# EAGLE design page1 (EAGLE 4.16)
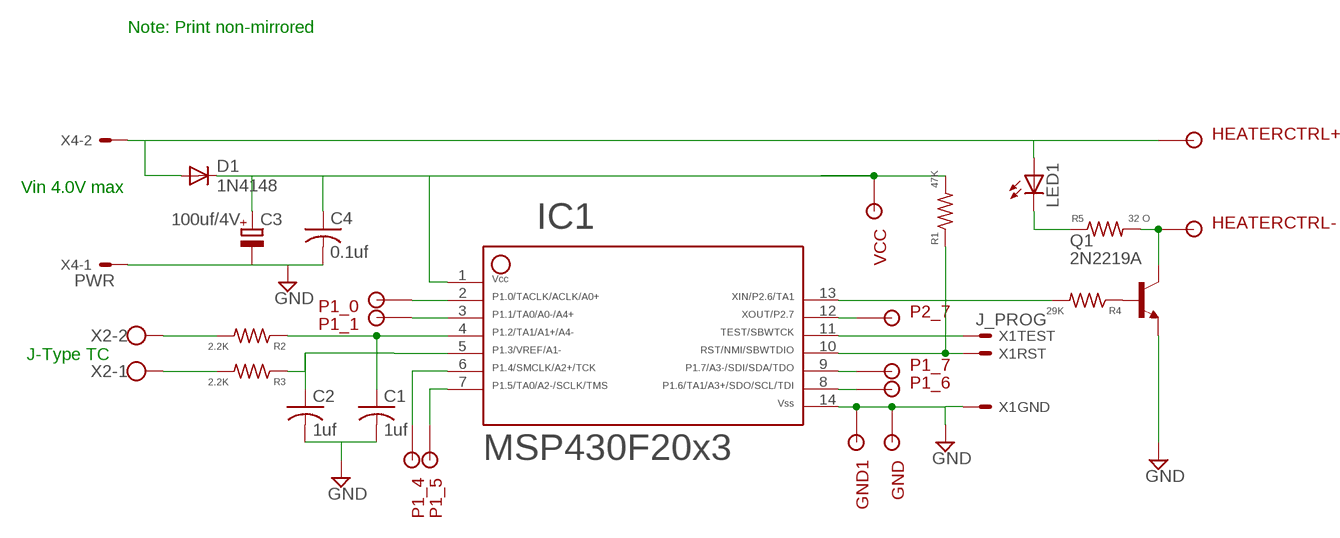
[diagram p0: schematic, sheet 1]

## Parts
C1  1uf  C-USC0805  [C0805]
C2  1uf  C-USC0805  [C0805]
C3  100uf/4V  CPOL-EUSMCB  [SMC_B]
C4  0.1uf  C-USC0805  [C0805]
D1  1N4148  [DIO-35-10]
GND  SOLDER_POINTA  [P1-13]
GND1  SOLDER_POINTA  [P1-13]
HEATERCTRL+  SOLDER_POINTA  [P1-13]
HEATERCTRL-  SOLDER_POINTA  [P1-13]
IC1  F20X3---N14  [N14]
LED1  LED5MM  [LED5MM]
P1_0  SOLDER_POINTA  [P1-13]
P1_1  SOLDER_POINTA  [P1-13]
P1_4  SOLDER_POINTA  [P1-13]
P1_5  SOLDER_POINTA  [P1-13]
P1_6  SOLDER_POINTA  [P1-13]
P1_7  SOLDER_POINTA  [P1-13]
P2_7  SOLDER_POINTA  [P1-13]
Q1  2N2219A  2N2219ATO92_EBC  [TO92-EBC]
R1  47K  R-US_M0805  [M0805]
R2  2.2K  R-US_M0805  [M0805]
R3  2.2K  R-US_M0805  [M0805]
R4  29K  R-US_M0805  [M0805]
R5  32 O  R-US_0207/15  [0207/15]
VCC  SOLDER_POINTA  [P1-13]
X1  J_PROG  J_PROG_MSP430  [MOLEX-3PIN]
X2  W237-102  [W237-102]
X4  PWR  22-23-2021  [22-23-2021]

## Nets
GND: C1.2 C2.2 C3.- C4.2 GND1.1 GND.1 IC1.14 Q1.E X1.3 X4.1
N$1: IC1.10 R1.1 X1.2
N$2: IC1.11 X1.1
N$3: C3.+ C4.1 D1.P$1(C) IC1.1 R1.2 VCC.1
N$4: R2.2 X2.2
N$5: R3.2 X2.1
N$6: Q1.B R4.1
N$7: C2.1 IC1.5 R3.1
N$8: D1.P$2(A) HEATERCTRL+.1 LED1.A X4.2
N$9: C1.1 IC1.4 R2.1
N$10: IC1.13 R4.2
N$11: HEATERCTRL-.1 Q1.C R5.2
N$12: LED1.K(C) R5.1
N$13: IC1.6 P1_4.1
N$14: IC1.7 P1_5.1
N$15: IC1.2 P1_0.1
N$16: IC1.3 P1_1.1
N$17: IC1.12 P2_7.1
N$18: IC1.9 P1_7.1
N$19: IC1.8 P1_6.1

## Notes on the sheet
- Note: Print non-mirrored
- Vin 4.0V max
- J-Type TC

## Library data of the parts
C1 C2 C4 = rcl:C-US: CAPACITOR, American symbol
C3 = rcl:CPOL-EU: POLARIZED CAPACITOR, European symbol
D1 = dedenbear:1N4148
GND GND1 HEATERCTRL+ HEATERCTRL- P1_0 P1_1 P1_4-P1_7 P2_7 VCC = Stofer:SOLDER_POINT
IC1 = TI_MSP430_v12:F20X3---N14: ***MSP430F20x3***N14
LED1 = led:LED: LED OSRAM: - CHIPLED LG R971, LG N971, LY N971, LG Q971, LY Q971, LO R971, LY R971 LH N974, LH R974 LS Q976, LO Q976, LY Q976 LO Q996 - Hyper CHIPLED LW Q18S LB Q993, LB Q99A, LB R99A - SideLED LS A670, LO A670, LY A670, LG A670, LP A670 LB A673, LV A673, LT A673, LW A673 LH A674 LY A675 LS A676, LA A676, LO A676, LY A676, LW A676 LS A679, LY A679, LG A679 - Hyper Micro SIDELED® LS Y876, LA Y876, LO Y876, LY Y876 LT Y87S - SmartLED LW L88C, LW L88S LB L89C, LB L89S, LG L890 LS L89K, LO L89K, LY L89K LS L896, LA L896, LO L896, LY L896 - TOPLED LS T670, LO T670, LY T670, LG T670, LP T670 LSG T670, LSP T670, LSY T670, LOP T670, LYG T670 LG T671, LOG T671, LSG T671 LB T673, LV T673, LT T673, LW T673 LH T674 LS T676, LA T676, LO T676, LY T676, LB T676, LH T676, LSB T676, LW T676 LB T67C, LV T67C, LT T67C, LS T67K, LO T67K, LY T67K, LW E67C LS E67B, LA E67B, LO E67B, LY E67B, LB E67C, LV E67C, LT E67C LW T67C LS T679, LY T679, LG T679 LS T770, LO T770, LY T770, LG T770, LP T770 LB T773, LV T773, LT T773, LW T773 LH T774 LS E675, LA E675, LY E675, LS T675 LS T776, LA T776, LO T776, LY T776, LB T776 LHGB T686 LT T68C, LB T68C - Hyper Mini TOPLED® LB M676 - Mini TOPLED Santana® LG M470 LS M47K, LO M47K, LY M47K Source: http://www.osram.convergy.de - LUMILED® LXK2-PW12-R00, LXK2-PW12-S00, LXK2-PW14-U00, LXK2-PW14-V00 LXK2-PM12-R00, LXK2-PM12-S00, LXK2-PM14-U00 LXK2-PE12-Q00, LXK2-PE12-R00, LXK2-PE12-S00, LXK2-PE14-T00, LXK2-PE14-U00 LXK2-PB12-K00, LXK2-PB12-L00, LXK2-PB12-M00, LXK2-PB14-N00, LXK2-PB14-P00, LXK2-PB14-Q00 LXK2-PR12-L00, LXK2-PR12-M00, LXK2-PR14-Q00, LXK2-PR14-R00 LXK2-PD12-Q00, LXK2-PD12-R00, LXK2-PD12-S00 LXK2-PH12-R00, LXK2-PH12-S00 LXK2-PL12-P00, LXK2-PL12-Q00, LXK2-PL12-R00 Source: www.luxeon.com
Q1 = transistor-npn:2N2219A: NPN Transistor
R1-R5 = rcl:R-US_: RESISTOR, American symbol
X1 = Stofer:J_PROG_MSP430: .100" (2.54mm) Center Header - 3 Pin
X2 = con-wago-500:W237-102: WAGO SCREW CLAMP
X4 = con-molex:22-23-2021: .100" (2.54mm) Center Header - 2 Pin

## Board
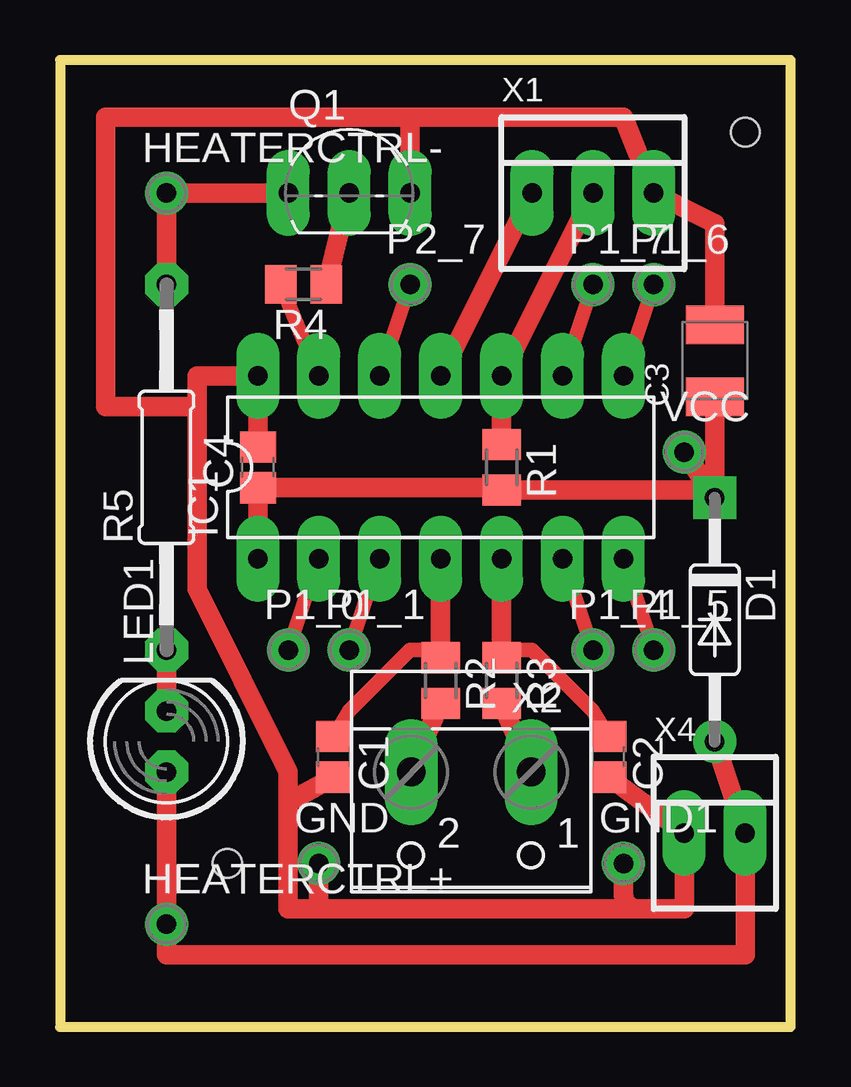
[diagram p1: board, top side]
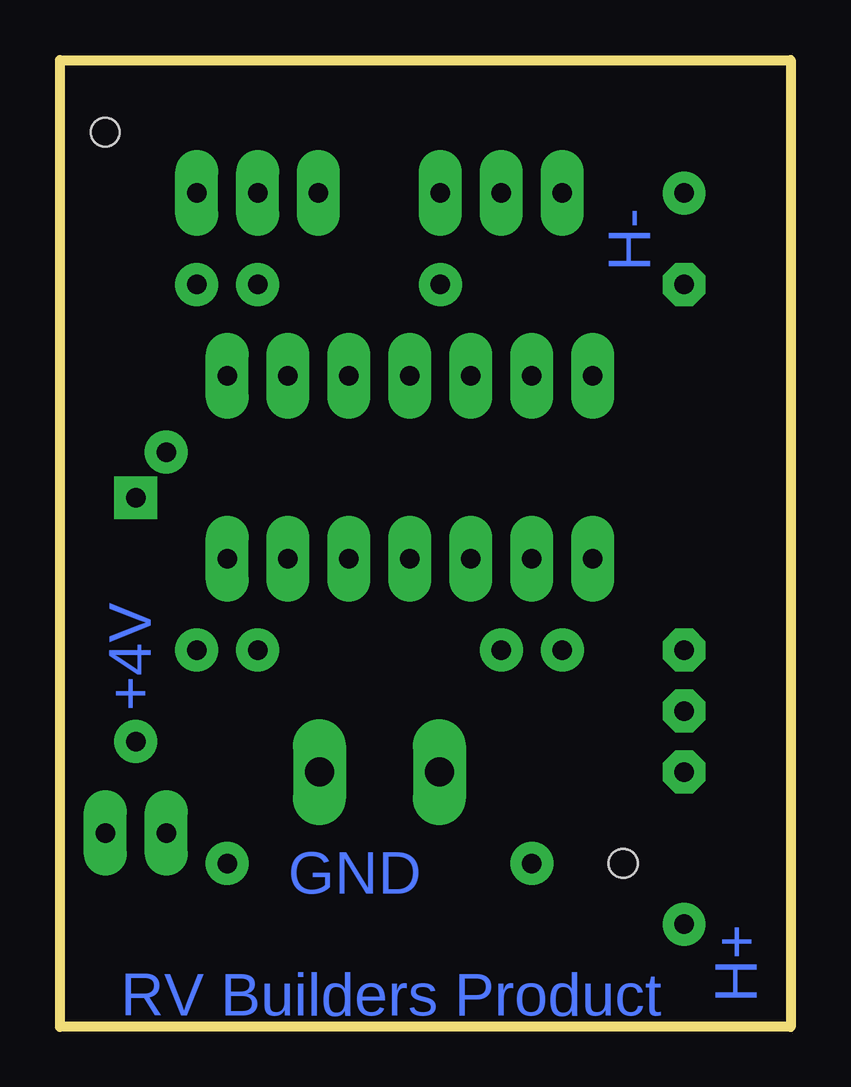
[diagram p2: board, bottom side, seen from below]

Size 30.46 x 40.31 mm. Coordinates in mm from the lower left corner, seen from the top.
Outline: 0,0 30.46,0 30.46,40.31 0,40.31 0,0
Copper layers (1*2+15*16): Top 0.035mm / dielectric 0.2mm / Route2 0.035mm / dielectric 0.15mm / Route15 0.035mm / dielectric 0.2mm / Bottom 0.035mm
Design rules "default": minimum track width 10mil, minimum drill 24mil, track to track 8mil, track to pad 8mil, pad to pad 8mil, via to via 8mil, smd to smd 8mil, copper to edge 40mil, drill to drill 8mil, minimum pad ring 10mil, minimum via ring 8mil, stop-mask expansion 4mil, vias tented up to drill 0mil, thermal gap 10mil
Holes 1.2 mm at 28.57,37.3 6.98,6.82

### Footprints (pad centres in the part's own frame; a part is rotated, then mirrored left to right if it is on the bottom)
C0805 = smd 1.3 x 1.5: 1 -0.85,0; 2 0.85,0
SMC_B = smd 1.6 x 2.4: + -1.5,0; - 1.5,0
DIO-35-10 = drill 0.813 square: P$1 -5.08,0 | drill 0.813 round: P$2 5.08,0
P1-13 = drill 0.813 round: 1 0,0
N14 = drill 0.813 long: 1 -8.89,-3.81; 2 -6.35,-3.81; 3 -3.81,-3.81; 4 -1.27,-3.81; 5 1.27,-3.81; 6 3.81,-3.81; 7 6.35,-3.81; 8 6.35,3.81; 9 3.81,3.81; 10 1.27,3.81; 11 -1.27,3.81; 12 -3.81,3.81; 13 -6.35,3.81; 14 -8.89,3.81
LED5MM = drill 0.813 pad 1.778 octagon: A -1.27,0; K 1.27,0
TO92-EBC = drill 0.813 long: B 0,-1.27; C -2.54,-1.27; E 2.54,-1.27
M0805 = smd 1.3 x 1.6: 1 -0.95,0; 2 0.95,0
0207/15 = drill 0.813 octagon: 1 -7.62,0; 2 7.62,0
MOLEX-3PIN = drill 0.813 long: 1 -2.54,0; 2 0,0; 3 2.54,0
W237-102 = drill 1.194 long: 1 -2.5,-1.27; 2 2.5,-1.27
22-23-2021 = drill 0.813 long: 1 -1.27,0; 2 1.27,0

### Placement (x,y rotation side)
C1  11.43,11.27 270 top
C2  22.86,11.27 270 top
C3  27.3,27.78 90 top
C4  8.25,23.33 90 top
D1  27.3,16.98 270 top
GND  10.79,6.82 0 top
GND1  23.49,6.82 0 top
HEATERCTRL+  4.44,4.28 0 top
HEATERCTRL-  4.44,34.76 0 top
IC1  17.14,23.33 0 top
LED1  4.44,11.9 90 top
P1_0  9.52,15.71 0 top
P1_1  12.06,15.71 0 top
P1_4  22.22,15.71 0 top
P1_5  24.76,15.71 0 top
P1_6  24.76,30.95 0 top
P1_7  22.22,30.95 0 top
P2_7  14.6,30.95 0 top
Q1  12.06,36.03 0 top
R1  18.41,23.33 270 top
R2  15.87,14.44 270 top
R3  18.41,14.44 270 top
R4  10.16,30.95 180 top
R5  4.44,23.33 90 top
VCC  26.03,23.96 0 top
X1  22.22,34.76 0 top
X2  17.14,9.36 180 top
X4  27.3,8.09 0 top

### Tracks (layer width: path | path; a pad name or v marks a point on that pad's centre or on a via)
GND
  Top 0.813: C4.2 IC1.14 5.71,27.14 5.71,25.87 | 26.03,4.92 X4.1 C2.2 | 10.79,4.92 9.52,4.92 9.52,9.36 | 10.79,4.92 26.03,4.92 | 14.6,37.93 23.49,37.93 X1.3 27.3,33.49 C3.- | 14.6,37.93 1.9,37.93 1.9,25.87 5.71,25.87 | 5.71,25.87 5.71,18.25 9.52,10.63 9.52,9.36 | 14.6,37.93 Q1.E | 9.52,9.36 C1.2 | GND1.1 23.49,5.55 arc90 24.12,4.92 26.03,4.92 | GND.1 10.79,4.92
N$1
  Top 0.813: R1.1 IC1.10 X1.2
N$2
  Top 0.813: IC1.11 X1.1
N$3
  Top 0.406: 18.41,22.06 R1.2 18.41,22.48
  Top 0.813: IC1.1 C4.1 18.41,22.48 | R1.2 26.98,22.38 arc-90 D1.P$1 | D1.P$1 C3.+ | D1.P$1 VCC.1
N$4
  Top 0.813: X2.2 14.6,10.63 R2.2
N$5
  Top 0.813: X2.1 19.68,10.63 R3.2
N$6
  Top 0.813: R4.1 Q1.B
N$7
  Top 0.61: R3.1 18.41,15.71 19.68,15.71 22.22,13.17 C2.1
  Top 0.813: 18.41,15.71 IC1.5
N$8
  Top 0.813: LED1.A HEATERCTRL+.1 4.44,3.01 28.57,3.01 X4.2 D1.P$2
N$9
  Top 0.61: R2.1 15.87,15.71 14.6,15.71 12.06,13.17 C1.1
  Top 0.813: 15.87,15.71 IC1.4
N$10
  Top 0.61: IC1.13 R4.2
N$11
  Top 0.813: Q1.C HEATERCTRL-.1 R5.2
N$12
  Top 0.813: LED1.K R5.1
N$13
  Top 0.61: P1_4.1 IC1.6
N$14
  Top 0.61: P1_5.1 IC1.7
N$15
  Top 0.61: P1_0.1 IC1.2
N$16
  Top 0.61: P1_1.1 IC1.3
N$17
  Top 0.61: IC1.12 P2_7.1
N$18
  Top 0.61: IC1.9 P1_7.1
N$19
  Top 0.61: IC1.8 P1_6.1

### Text on the board
Bottom: H- | +4V | GND | H+ | RV Builders Product